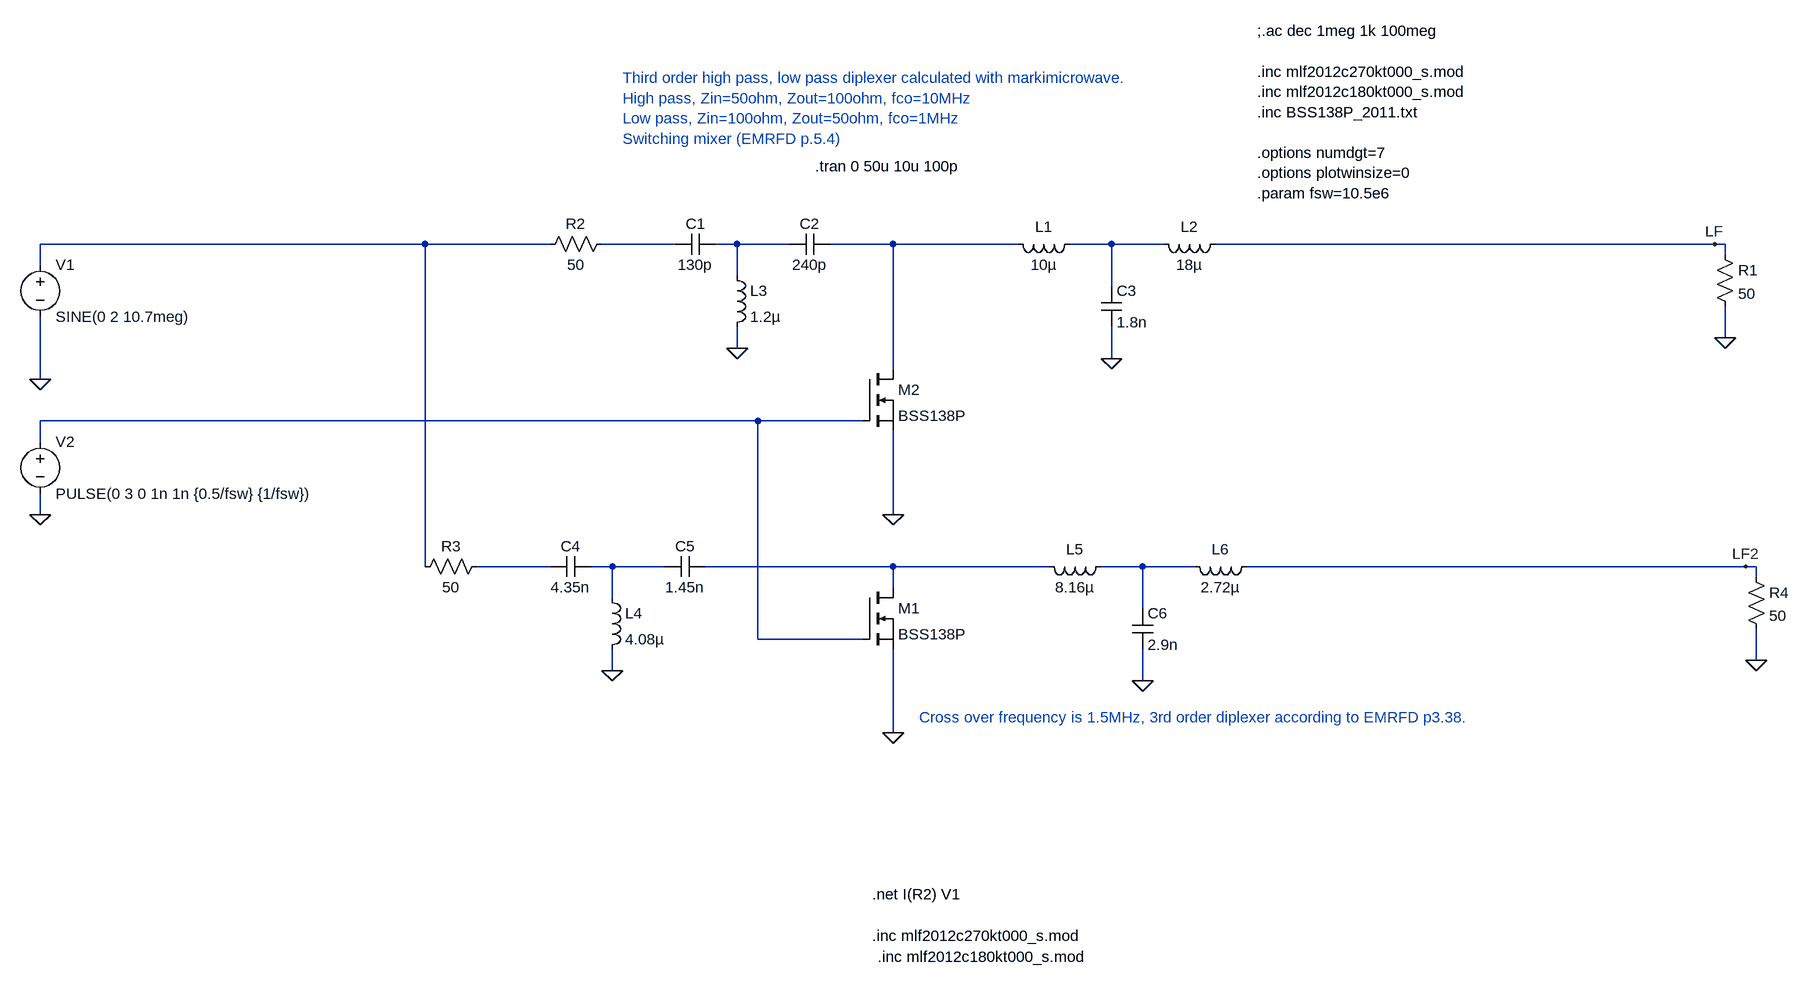
[diagram p0: schematic switching_mixer.asc]
switching_mixer.asc, the LTspice schematic file:
Version 4
SHEET 1 1352 1032
WIRE -752 -80 -1344 -80
WIRE -560 -80 -752 -80
WIRE -368 -80 -480 -80
WIRE -272 -80 -304 -80
WIRE -192 -80 -272 -80
WIRE -32 -80 -128 -80
WIRE 160 -80 -32 -80
WIRE 304 -80 240 -80
WIRE 384 -80 304 -80
WIRE 1232 -80 464 -80
WIRE 1248 -80 1232 -80
WIRE 1248 -64 1248 -80
WIRE -1344 -48 -1344 -80
WIRE -272 -32 -272 -80
WIRE 304 -16 304 -80
WIRE 1248 64 1248 16
WIRE -272 80 -272 48
WIRE 304 96 304 48
WIRE -32 112 -32 -80
WIRE -1344 128 -1344 32
WIRE -240 192 -1344 192
WIRE -80 192 -240 192
WIRE -1344 224 -1344 192
WIRE -1344 336 -1344 304
WIRE -32 336 -32 208
WIRE -752 416 -752 -80
WIRE -560 416 -672 416
WIRE -464 416 -496 416
WIRE -384 416 -464 416
WIRE -32 416 -320 416
WIRE 208 416 -32 416
WIRE 352 416 288 416
WIRE 432 416 352 416
WIRE 1280 416 512 416
WIRE 1296 416 1280 416
WIRE 1296 432 1296 416
WIRE -32 448 -32 416
WIRE -464 464 -464 416
WIRE 352 480 352 416
WIRE -240 528 -240 192
WIRE -80 528 -240 528
WIRE 1296 560 1296 512
WIRE -464 576 -464 544
WIRE 352 592 352 544
WIRE -32 672 -32 544
FLAG 1248 64 0
FLAG 1232 -80 LF
FLAG -1344 128 0
FLAG -32 336 0
FLAG -1344 336 0
FLAG -272 80 0
FLAG 304 96 0
FLAG -32 672 0
FLAG -464 576 0
FLAG 1296 560 0
FLAG 1280 416 LF2
FLAG 352 592 0
SYMBOL res 1232 -80 R0
SYMATTR InstName R1
SYMATTR Value 50
SYMBOL voltage -1344 -64 R0
WINDOW 123 0 0 Left 0
WINDOW 39 24 44 Left 2
SYMATTR InstName V1
SYMATTR Value SINE(0 2 10.7meg)
SYMBOL voltage -1344 208 R0
WINDOW 123 0 0 Left 0
WINDOW 39 0 0 Left 0
SYMATTR InstName V2
SYMATTR Value PULSE(0 3 0 1n 1n {0.5/fsw} {1/fsw})
SYMBOL nmos -80 112 R0
SYMATTR InstName M2
SYMATTR Value BSS138P
SYMATTR Prefix X
SYMBOL cap -304 -96 R90
WINDOW 0 0 32 VBottom 2
WINDOW 3 32 32 VTop 2
SYMATTR InstName C1
SYMATTR Value 130p
SYMBOL ind 256 -96 R90
WINDOW 0 5 56 VBottom 2
WINDOW 3 32 56 VTop 2
SYMATTR InstName L1
SYMATTR Value 10µ
SYMBOL ind 480 -96 R90
WINDOW 0 5 56 VBottom 2
WINDOW 3 32 56 VTop 2
SYMATTR InstName L2
SYMATTR Value 18µ
SYMBOL ind -288 -48 R0
SYMATTR InstName L3
SYMATTR Value 1.2µ
SYMBOL cap -128 -96 R90
WINDOW 0 0 32 VBottom 2
WINDOW 3 32 32 VTop 2
SYMATTR InstName C2
SYMATTR Value 240p
SYMBOL cap 288 -16 R0
SYMATTR InstName C3
SYMATTR Value 1.8n
SYMBOL nmos -80 448 R0
SYMATTR InstName M1
SYMATTR Value BSS138P
SYMATTR Prefix X
SYMBOL res -464 -96 R90
WINDOW 0 0 56 VBottom 2
WINDOW 3 32 56 VTop 2
SYMATTR InstName R2
SYMATTR Value 50
SYMBOL cap -496 400 R90
WINDOW 0 0 32 VBottom 2
WINDOW 3 32 32 VTop 2
SYMATTR InstName C4
SYMATTR Value 4.35n
SYMBOL ind -480 448 R0
SYMATTR InstName L4
SYMATTR Value 4.08µ
SYMBOL cap -320 400 R90
WINDOW 0 0 32 VBottom 2
WINDOW 3 32 32 VTop 2
SYMATTR InstName C5
SYMATTR Value 1.45n
SYMBOL res -656 400 R90
WINDOW 0 0 56 VBottom 2
WINDOW 3 32 56 VTop 2
SYMATTR InstName R3
SYMATTR Value 50
SYMBOL res 1280 416 R0
SYMATTR InstName R4
SYMATTR Value 50
SYMBOL ind 304 400 R90
WINDOW 0 5 56 VBottom 2
WINDOW 3 32 56 VTop 2
SYMATTR InstName L5
SYMATTR Value 8.16µ
SYMBOL ind 528 400 R90
WINDOW 0 5 56 VBottom 2
WINDOW 3 32 56 VTop 2
SYMATTR InstName L6
SYMATTR Value 2.72µ
SYMBOL cap 336 480 R0
SYMATTR InstName C6
SYMATTR Value 2.9n
TEXT 528 -408 Left 2 !;.ac dec 1meg 1k 100meg\n \n.inc mlf2012c270kt000_s.mod\n.inc mlf2012c180kt000_s.mod\n.inc BSS138P_2011.txt\n \n.options numdgt=7\n.options plotwinsize=0\n.param fsw=10.5e6
TEXT -448 -336 Left 2 ;Third order high pass, low pass diplexer calculated with markimicrowave.\nHigh pass, Zin=50ohm, Zout=100ohm, fco=10MHz\nLow pass, Zin=100ohm, Zout=50ohm, fco=1MHz\nSwitching mixer (EMRFD p.5.4)
TEXT -152 -200 Left 2 !.tran 0 50u 10u 100p
TEXT -64 920 Left 2 !.net I(R2) V1
TEXT -64 984 Left 2 !.inc mlf2012c270kt000_s.mod
TEXT -56 1016 Left 2 !.inc mlf2012c180kt000_s.mod
TEXT 8 648 Left 2 ;Cross over frequency is 1.5MHz, 3rd order diplexer according to EMRFD p3.38.

The netlist it stands for:
* switching_mixer.asc
R1 LF 0 50
V1 N001 0 SINE(0 2 10.7meg)
V2 N006 0 PULSE(0 3 0 1n 1n {0.5/fsw} {1/fsw})
XM2 N004 N006 0 BSS138P  ; pins D G S
C1 N003 N002 130p
L1 N005 N004 10µ
L2 LF N005 18µ
L3 N003 0 1.2µ
C2 N004 N003 240p
C3 N005 0 1.8n
XM1 N009 N006 0 BSS138P  ; pins D G S
R2 N002 N001 50
C4 N008 N007 4.35n
L4 N008 0 4.08µ
C5 N009 N008 1.45n
R3 N007 N001 50
R4 LF2 0 50
L5 N010 N009 8.16µ
L6 LF2 N010 2.72µ
C6 N010 0 2.9n
;.ac dec 1meg 1k 100meg
.inc mlf2012c270kt000_s.mod
.inc mlf2012c180kt000_s.mod
.inc BSS138P_2011.txt
.options numdgt=7
.options plotwinsize=0
.param fsw=10.5e6
* Third order high pass, low pass diplexer calculated with markimicrowave.
* High pass, Zin=50ohm, Zout=100ohm, fco=10MHz
* Low pass, Zin=100ohm, Zout=50ohm, fco=1MHz
* Switching mixer (EMRFD p.5.4)
.tran 0 50u 10u 100p
.net I(R2) V1
.inc mlf2012c270kt000_s.mod
.inc mlf2012c180kt000_s.mod
* Cross over frequency is 1.5MHz, 3rd order diplexer according to EMRFD p3.38.
.backanno
.end